# Altium schematic sheet Inputs.SchDoc: Digital and Analog Inputs
size Letter; Date: 2017-02-17; Revision: A; SheetNumber: 9; SheetTotal: 11; ProjectTitle: PDUv17: Power Distribution Unit
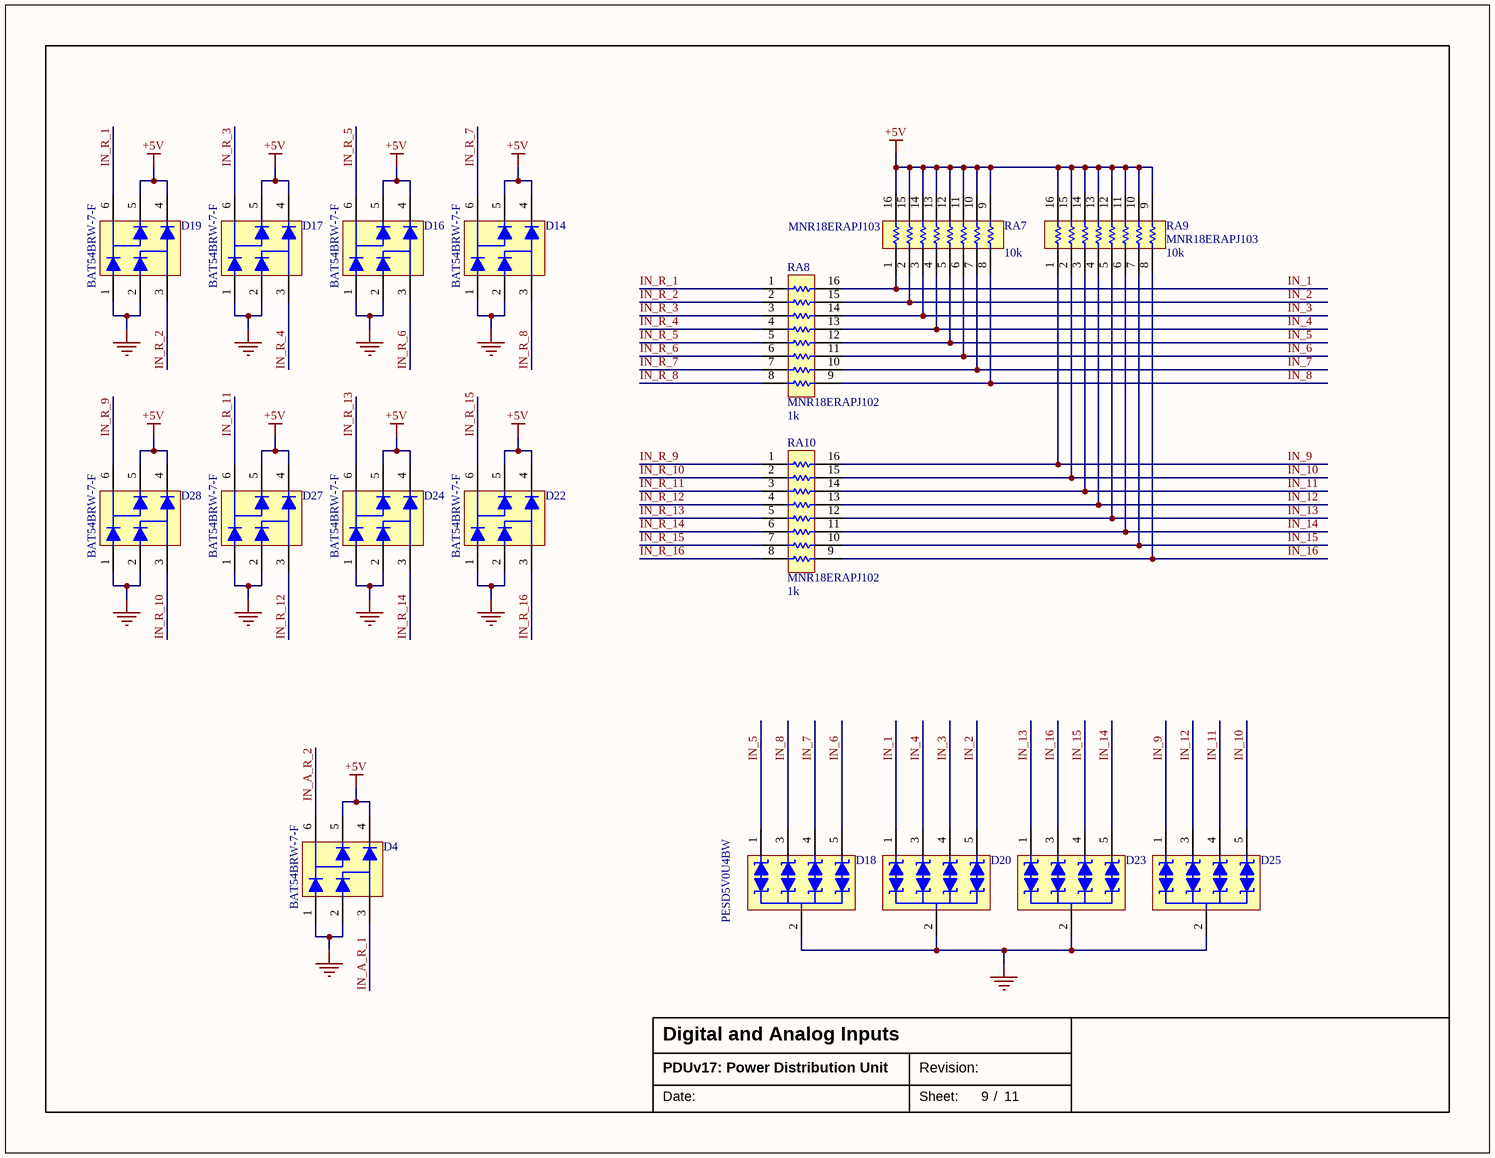
[diagram p0: Inputs.SchDoc]

## Parts
D4  BAT54BRW-7-F  [SOT65P210X110-6N]
D14  BAT54BRW-7-F  [SOT65P210X110-6N]
D16  BAT54BRW-7-F  [SOT65P210X110-6N]
D17  BAT54BRW-7-F  [SOT65P210X110-6N]
D18  PESD5V0U4BW  [SOTFL50P160X60-5N]
D19  BAT54BRW-7-F  [SOT65P210X110-6N]
D20  PESD5V0U4BW  [SOTFL50P160X60-5N]  (value not drawn)
D22  BAT54BRW-7-F  [SOT65P210X110-6N]
D23  PESD5V0U4BW  [SOTFL50P160X60-5N]  (value not drawn)
D24  BAT54BRW-7-F  [SOT65P210X110-6N]
D25  PESD5V0U4BW  [SOTFL50P160X60-5N]  (value not drawn)
D27  BAT54BRW-7-F  [SOT65P210X110-6N]
D28  BAT54BRW-7-F  [SOT65P210X110-6N]
RA7  MNR18ERAPJ103  value 10k  [CAC-50P379X150-16N]
RA8  MNR18ERAPJ102  value 1k  [CAC-50P379X150-16N]
RA9  MNR18ERAPJ103  value 10k  [CAC-50P379X150-16N]
RA10  MNR18ERAPJ102  value 1k  [CAC-50P379X150-16N]

## Nets
+5V: D4.4 D4.5 D14.4 D14.5 D16.4 D16.5 D17.4 D17.5 D19.4 D19.5 D22.4 D22.5 D24.4 D24.5 D27.4 D27.5 D28.4 D28.5 RA7.9 RA7.10 RA7.11 RA7.12 RA7.13 RA7.14 RA7.15 RA7.16 RA9.9 RA9.10 RA9.11 RA9.12 RA9.13 RA9.14 RA9.15 RA9.16
GND: D4.1 D4.2 D14.1 D14.2 D16.1 D16.2 D17.1 D17.2 D18.2 D19.1 D19.2 D20.2 D22.1 D22.2 D23.2 D24.1 D24.2 D25.2 D27.1 D27.2 D28.1 D28.2
IN_1: D20.1 RA7.1 RA8.16
IN_2: D20.5 RA7.2 RA8.15
IN_3: D20.4 RA7.3 RA8.14
IN_4: D20.3 RA7.4 RA8.13
IN_5: D18.1 RA7.5 RA8.12
IN_6: D18.5 RA7.6 RA8.11
IN_7: D18.4 RA7.7 RA8.10
IN_8: D18.3 RA7.8 RA8.9
IN_9: D25.1 RA9.1 RA10.16
IN_10: D25.5 RA9.2 RA10.15
IN_11: D25.4 RA9.3 RA10.14
IN_12: D25.3 RA9.4 RA10.13
IN_13: D23.1 RA9.5 RA10.12
IN_14: D23.5 RA9.6 RA10.11
IN_15: D23.4 RA9.7 RA10.10
IN_16: D23.3 RA9.8 RA10.9
IN_A_R_1: D4.3
IN_A_R_2: D4.6
IN_R_1: D19.6 RA8.1
IN_R_2: D19.3 RA8.2
IN_R_3: D17.6 RA8.3
IN_R_4: D17.3 RA8.4
IN_R_5: D16.6 RA8.5
IN_R_6: D16.3 RA8.6
IN_R_7: D14.6 RA8.7
IN_R_8: D14.3 RA8.8
IN_R_9: D28.6 RA10.1
IN_R_10: D28.3 RA10.2
IN_R_11: D27.6 RA10.3
IN_R_12: D27.3 RA10.4
IN_R_13: D24.6 RA10.5
IN_R_14: D24.3 RA10.6
IN_R_15: D22.6 RA10.7
IN_R_16: D22.3 RA10.8

## Notes on the sheet
- Date:
- Revision:
- Sheet:
- /